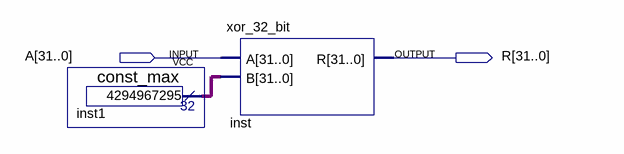
[diagram p0: schematic sheet]
// Quartus schematic not_32_bit.bdf as structural Verilog: 2 symbols, 2 pins
module not_32_bit (
  input  [31:0] A,
  output [31:0] R
);

  wire [31:0] inst1_result;

  const_max inst1 (.result(inst1_result));
  xor_32_bit inst (.A(A), .B(inst1_result), .R(R));
endmodule
